# Altium schematic sheet Touch_MediumWheel.SchDoc
size B; Organization: SmartHalo; Address1: 5445 de Gaspé; Address2: Montréal, QC; Address3: Canada; Address4: H2T 3B2
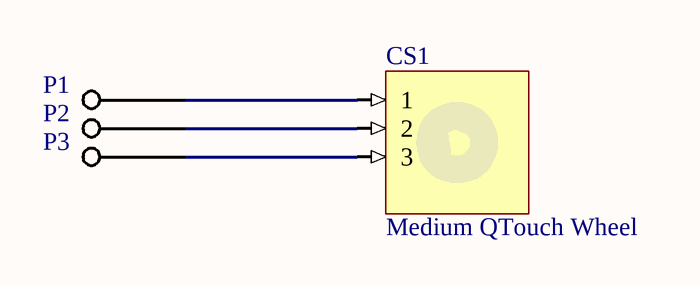
[diagram p0: Touch_MediumWheel.SchDoc]

## Parts
CS1  Medium QTouch Wheel  (no BOM)
P1  PAD_27x27MILS  [PAD_27x27MILS]  (value not drawn)  (no BOM)
P2  PAD_27x27MILS  [PAD_27x27MILS]  (value not drawn)  (no BOM)
P3  PAD_27x27MILS  [PAD_27x27MILS]  (value not drawn)  (no BOM)

## Nets
NetCS1_1: CS1.1 P1.1
NetCS1_2: CS1.2 P2.1
NetCS1_3: CS1.3 P3.1

## Notes on the sheet
- Title
- Size:
- Date:
- B
- Author:
- Time:
- Sheet
- Revision:
- of
- File:

## Library data of the parts
CS1 = MediumQTouchWheel: ConfiguratorName: ATMEL_TOUCH; ConfigurationParameters: {}__sensorid[8]{}odiameter[20]{}idiameter[10]{}gapthickness[0.3]{}
P1-P3 = PAD_27x27MILS: 27 x 27 mils PAD connection